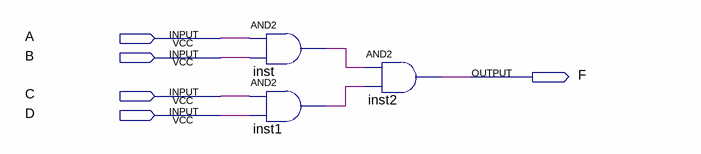
[diagram p0: schematic sheet]
// Quartus schematic four_andGate.bdf as structural Verilog: 3 symbols, 5 pins
module four_andGate (
  input  A,
  input  B,
  input  C,
  input  D,
  output F
);

  wire inst1_out, inst_out;

  and inst (inst_out, A, B);
  and inst1 (inst1_out, C, D);
  and inst2 (F, inst_out, inst1_out);
endmodule
